# EasyEDA Pro project 呆瓜风扇.epro

# Schematic Schematic1
Board Name: Board1; Create Date: 2024-10-28
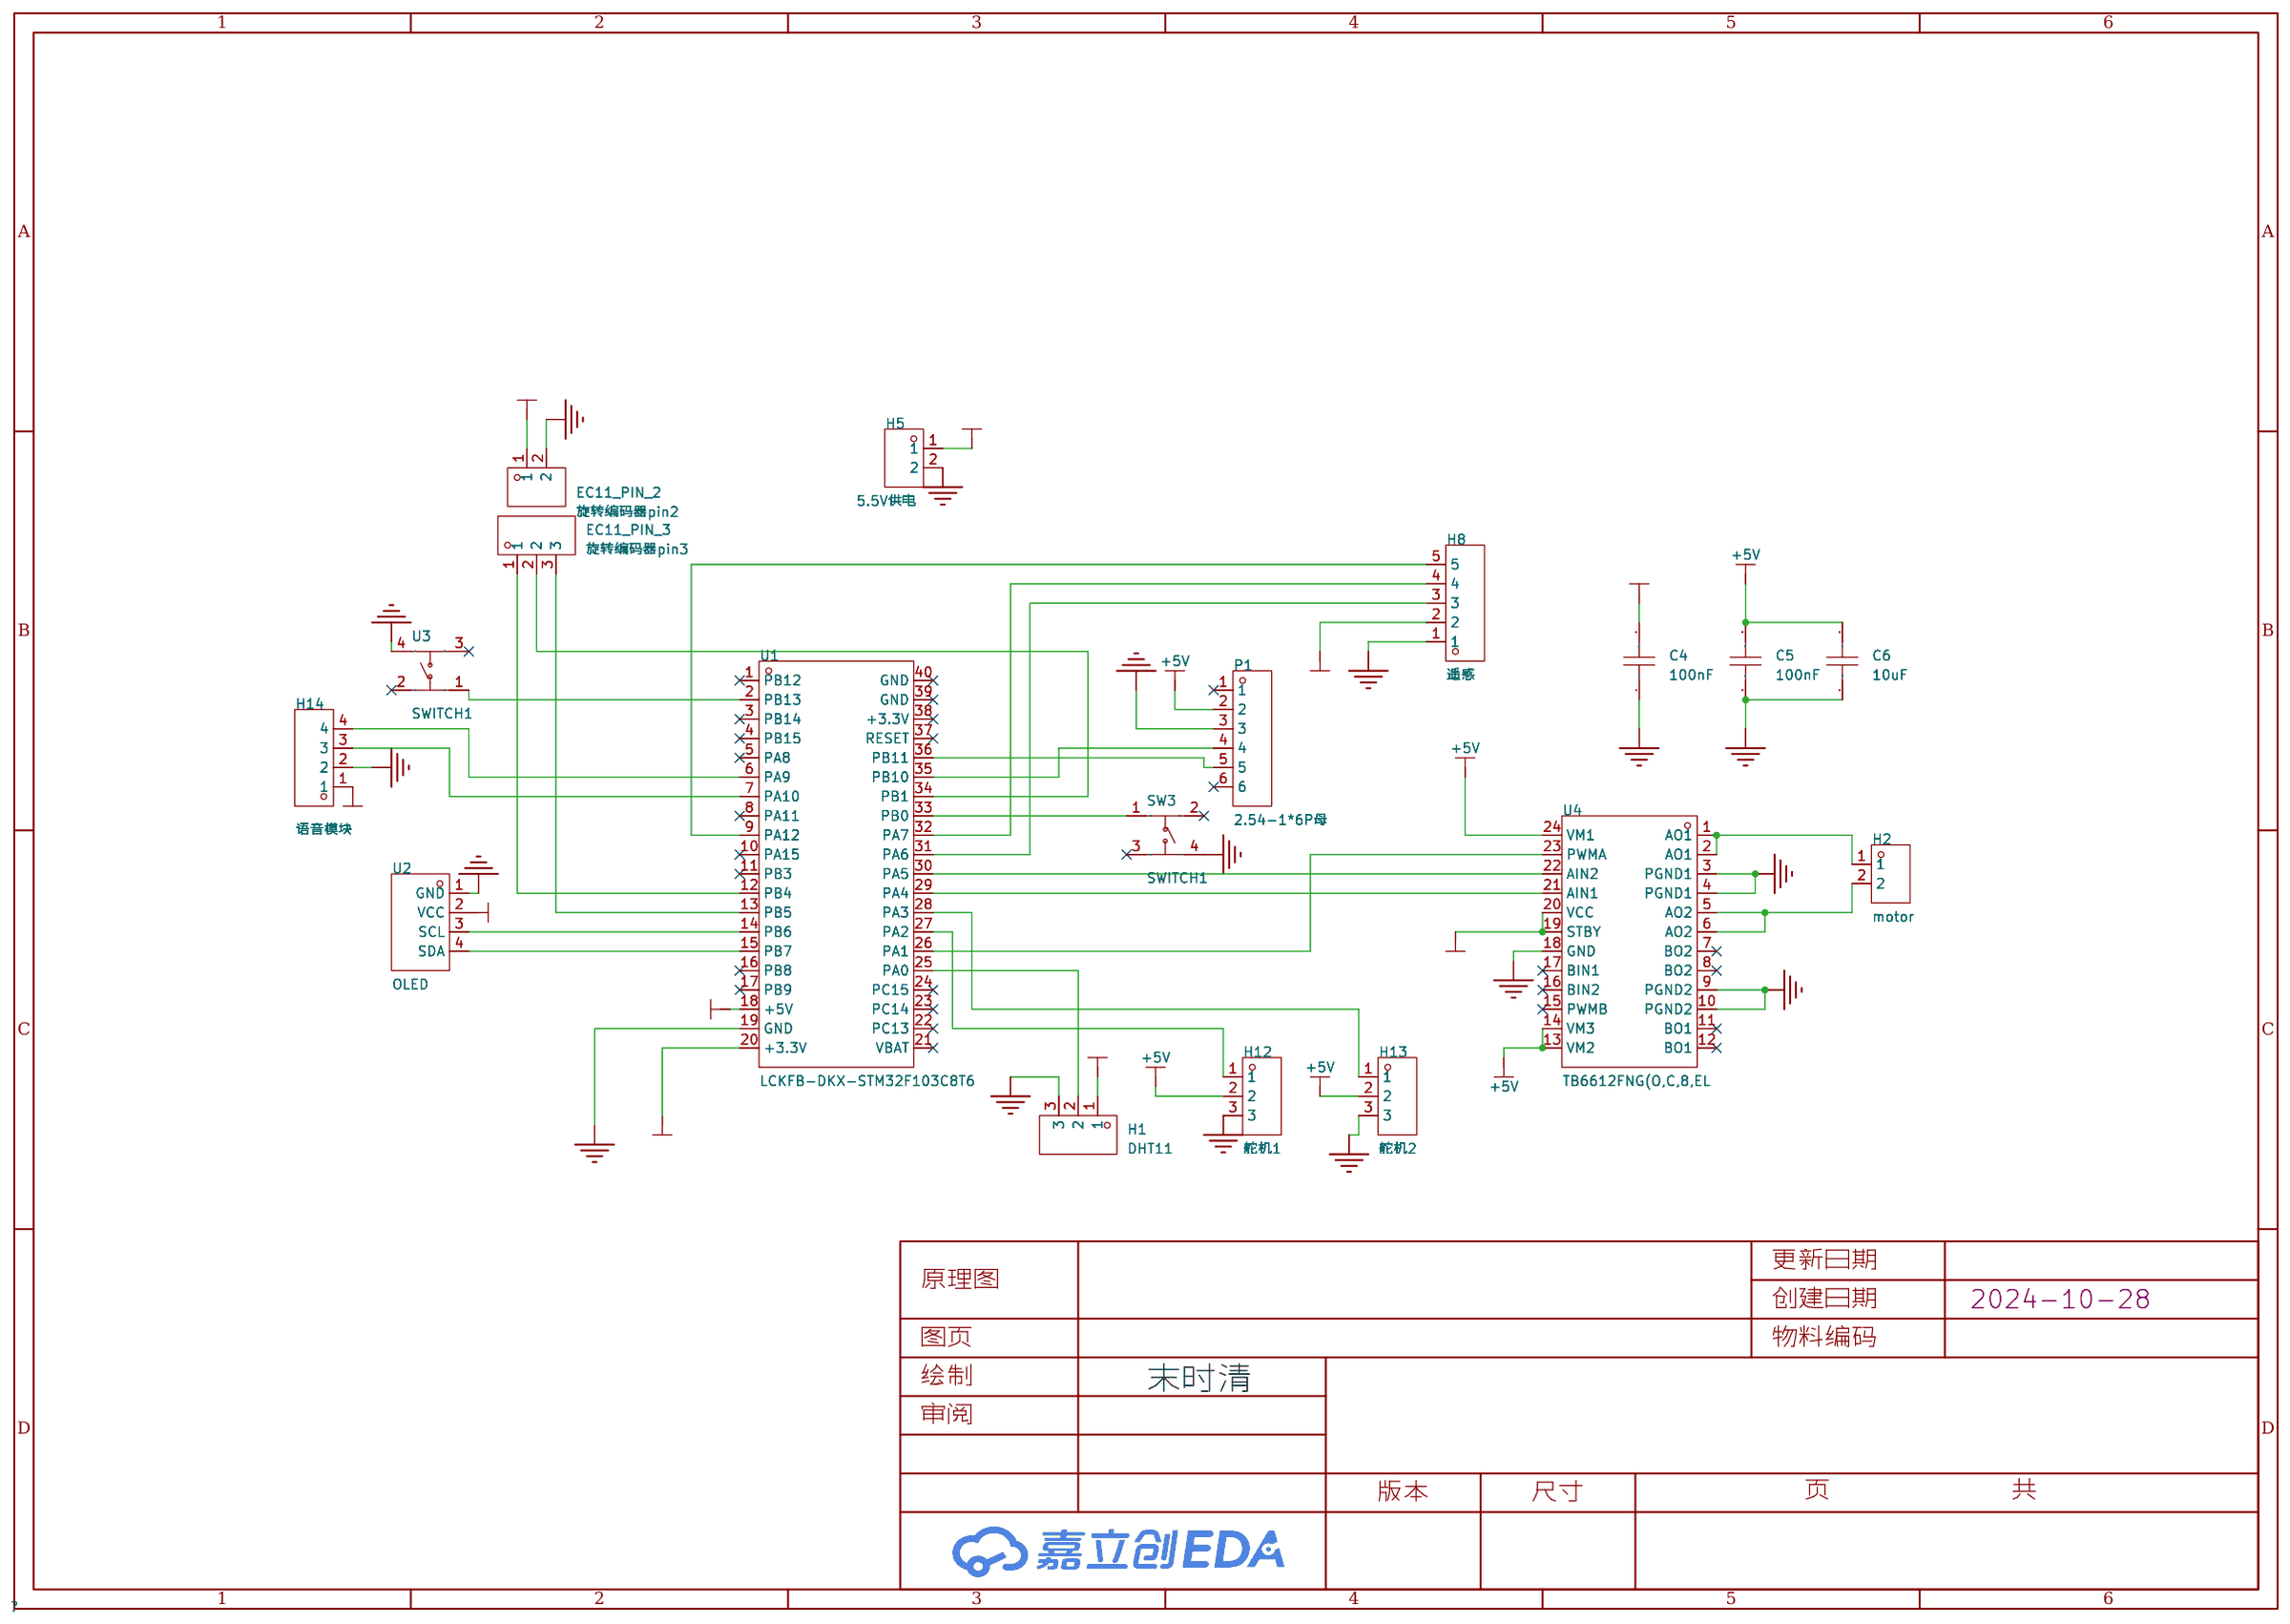
[diagram p0: schematic sheet]

## Parts
C4  100nF  [C0805]
C5  100nF  [C0805]
C6  100nF  [C0805]
EC11_PIN_2  旋转编码器pin2  [HDR-TH_2P-P2.54-V-M]
EC11_PIN_3  旋转编码器pin3  [HDR-TH_3P-P2.54-V-M]
H1  DHT11  [HDR-TH_3P-P2.54-V-F]
H2  motor  [HDR-TH_2P-P2.54-V-M]
H5  5.5V供电  [HDR-TH_2P-P2.54-V-M]
H8  遥感  [HDR-TH_5P-P2.54-V-M]
H12  舵机1  [HDR-TH_3P-P2.54-V-M]
H13  舵机2  [HDR-TH_3P-P2.54-V-M]
H14  语音模块  [HDR-TH_4P-P2.54-V-M]
P1  2.54-1*6P母  [HDR-TH_6P-P2.54-V-F]
SW3  SWITCH1  [SW-SMD_4P-L6.0-W6.0-P4.50-LS9.0-2]
U1  LCKFB-DKX-STM32F103C8T6  [CONN-TH_L53.3-W22.9_STM32F103C8T6-CARD]
U2  OLED  [OLED-TH_L27.8-W27.2-P2.54_C9900033791]
U3  SWITCH1  [SW-SMD_4P-L6.0-W6.0-P4.50-LS9.0-2]
U4  TB6612FNG(O,C,8,EL  [SSOP-24_L8.4-W5.8-P0.65-LS7.8-BL]

## Library data of the parts
C4-C6 = CAP_0805: Supplier Footprint: 0805
EC11_PIN_2 H2 H5 = PZ254V-11-02P: 插针结构:1x2P;间距:2.54mm;行距:-;圆针/方针:方针;安装类型:直插;排数:单排;总PIN位数:2P;额定电流:-;额定电压:-;配合针长度:6mm;塑高:2.5mm;端接针长度:3mm;触头材质:黄铜;触头镀层:-;工作温度范围:-40℃~+105℃;颜色:黑色;; LCSC Part Name: 间距:2.54mm 1x2P 直插 方针; Supplier Part: C492401; Manufacturer: XFCN(兴飞); Supplier Footprint: 插件,P=2.54mm; JLCPCB Part Class: 扩展库; Datasheet: https://atta.szlcsc.com/upload/public/pdf/source/20200309/C492401_A812433581A9B211A7FFA413ADDFF0E5.pdf; Supplier: LCSC; Pin Structure: 1x2P; Pitch: 2.54mm; Circluar Pins/Square Pins: 方针; Mounting Type: 直插; Number of Rows: 单排; Number of Pins: 2P; Length of Mating Pin: 6mm; Insulation Height: 2.5mm; Length of End Connection Pin: 3mm; Contact Material: 黄铜; Operating Temperature Range: -40℃~+105℃; Color: 黑色
EC11_PIN_3 H12 H13 = PZ254V-11-03P: 插针结构:1x3P;间距:2.54mm;行距:-;圆针/方针:方针;安装类型:直插;排数:单排;总PIN位数:3P;额定电流:3A;额定电压:250V;配合针长度:6mm;塑高:2.5mm;端接针长度:3mm;工作温度范围:-40℃~+105℃;颜色:黑色;; LCSC Part Name: 间距:2.54mm 1x3P 直插 方针; Supplier Part: C2937625; Manufacturer: XFCN(兴飞); Supplier Footprint: 插件,P=2.54mm; JLCPCB Part Class: 扩展库; Datasheet: https://atta.szlcsc.com/upload/public/pdf/source/20200309/C492402_8335C3D49C4E4C618838D59BB1D024C1.pdf; Supplier: LCSC; Pin Structure: 1x3P; Pitch: 2.54mm; Circluar Pins/Square Pins: 方针; Mounting Type: 直插; Number of Rows: 单排; Number of Pins: 3P; Current Rating (Max): 3A; Voltage Rating (Max): 250V; Length of Mating Pin: 6mm; Insulation Height: 2.5mm; Length of End Connection Pin: 3mm; Operating Temperature Range: -40℃~+105℃; Color: 黑色
H1 = PM254V-11-03-H85: 插孔结构:1x3P;间距:2.54mm;行距:-;安装类型:直插;排数:单排;总孔位数:3P;塑高:-;触头材质:黄铜;触头镀层:-;; LCSC Part Name: 间距:2.54mm 1x3P 直插; Supplier Part: C541850; Manufacturer: XFCN(兴飞); Supplier Footprint: 插件,P=2.54mm; JLCPCB Part Class: 扩展库; Datasheet: https://atta.szlcsc.com/upload/public/pdf/source/20200518/C541849_85853D71FC67C51915A806977A588FDA.pdf; Supplier: LCSC; Holes Structure: 1x3P; Pitch: 2.54mm; Mounting Type: 直插; Number of Rows: 单排; Number of Holes: 3P; Contact Material: 黄铜
H8 = PZ254V-11-05P: 插针结构:1x5P;间距:2.54mm;行距:-;圆针/方针:方针;安装类型:直插;排数:单排;总PIN位数:5P;额定电流:-;额定电压:-;配合针长度:6mm;塑高:2.5mm;端接针长度:3mm;触头材质:黄铜;触头镀层:-;工作温度范围:-40℃~+105℃;颜色:黑色;; LCSC Part Name: 间距:2.54mm 1x5P 直插 方针; Supplier Part: C492404; Manufacturer: XFCN(兴飞); Supplier Footprint: 插件,P=2.54mm; JLCPCB Part Class: 扩展库; Datasheet: https://atta.szlcsc.com/upload/public/pdf/source/20200309/C492404_E51533260F8710EFF5D4617281164C1D.pdf; Supplier: LCSC; Pin Structure: 1x5P; Pitch: 2.54mm; Circluar Pins/Square Pins: 方针; Mounting Type: 直插; Number of Rows: 单排; Number of Pins: 5P; Length of Mating Pin: 6mm; Insulation Height: 2.5mm; Length of End Connection Pin: 3mm; Contact Material: 黄铜; Operating Temperature Range: -40℃~+105℃; Color: 黑色
H14 = PZ254V-11-04P: 插针结构:1x4P;间距:2.54mm;行距:-;圆针/方针:方针;安装类型:直插;排数:单排;总PIN位数:4P;额定电流:3A;额定电压:250V;配合针长度:6mm;塑高:2.5mm;端接针长度:3mm;触头材质:-;工作温度范围:-40℃~+105℃;颜色:黑色;; LCSC Part Name: 间距:2.54mm 1x4P 直插 方针; Supplier Part: C2691448; Manufacturer: XFCN(兴飞); Supplier Footprint: 插件,P=2.54mm; JLCPCB Part Class: 扩展库; Datasheet: https://atta.szlcsc.com/upload/public/pdf/source/20200309/C492403_F9F19131791D08044AD4F84F8E751A34.pdf; Supplier: LCSC; Pin Structure: 1x4P; Pitch: 2.54mm; Circluar Pins/Square Pins: 方针; Mounting Type: 直插; Number of Rows: 单排; Number of Pins: 4P; Current Rating (Max): 3A; Voltage Rating (Max): 250V; Length of Mating Pin: 6mm; Insulation Height: 2.5mm; Length of End Connection Pin: 3mm; Operating Temperature Range: -40℃~+105℃; Color: 黑色
P1 = 2.54-1*6P母: 插孔结构:1x6P;间距:2.54mm;行距:-;安装类型:直插;排数:单排;总孔位数:6P;塑高:-;触头材质:-;触头镀层:-;; LCSC Part Name: 间距:2.54mm 1x6P 直插; Supplier Part: C40877; Manufacturer: BOOMELE(博穆精密); Supplier Footprint: 插件,P=2.54mm; JLCPCB Part Class: 扩展库; Datasheet: https://atta.szlcsc.com/upload/public/pdf/source/20210301/C2718488_F4427B881E42CAA8DDB0B1C12B3A522C.pdf; Supplier: LCSC; Holes Structure: 1x6P; Pitch: 2.54mm; Mounting Type: 直插; Number of Rows: 单排; Number of Holes: 6P
SW3 U3 = KH-6X6X5H-STM: 电路结构:单刀单掷;按钮形状:圆形按钮;安装方式:立贴;开关长度:6mm;开关宽度:6mm;开关高度:5mm;带支架:不带;触点电流:50mA;额定电压(DC):12V;机械寿命:8万次;; LCSC Part Name: 6*6*5mm 立贴 轻触开关; Supplier Part: C2837531; Manufacturer: kinghelm(金航标); Supplier Footprint: SMD; JLCPCB Part Class: 扩展库; Datasheet: https://atta.szlcsc.com/upload/public/pdf/source/20210608/C2837531_45E87AB996CE723B09405FF2EA209C4C.pdf; Supplier: LCSC; Circuit: 单刀单掷; Actuator Style: 圆形按钮; Mounting Style: 立贴; Switch Length: 6mm; Switch Width: 6mm; Switch Height: 5mm; Strike Gundam: 不带; Contact Current: 50mA; Voltage Rating (DC): 12V; Actuator/Cap Color: 黑色; Pin Style: 鸥翼型; Mechanical Life: 8万次
U1 = LCKFB-DKX-STM32F103C8T6: LCSC Part Name: 立创·地阔星-STM32F103C8T6开发板; Supplier Part: C22396880; Manufacturer: 立创开发板; JLCPCB Part Class: 扩展库; Datasheet: https://atta.szlcsc.com/upload/public/pdf/source/20240801/7EEF69F7480DF7C6DA98696664D658D4.pdf; Supplier: LCSC
U2 = HS96L03W2C03: 主控芯片:SSD1315;接口类型:I2C;尺寸(inch):0.96;像素分辨率:128x64;; LCSC Part Name: 0.96寸OLED显示屏窄白光IIC; Supplier Part: C5248080; Manufacturer: HS(汉昇); JLCPCB Part Class: 扩展库; Datasheet: https://atta.szlcsc.com/upload/public/pdf/source/20230627/763D01F79A90007632F098068C7C8AD9.pdf; Supplier: LCSC; Main Control Chip: SSD1315; Interface Type: I2C; Size: 0.96; Pixel Resolution: 128x64; Operating Temperature: -40℃~+70℃
U4 = TB6612FNG(O,C,8,EL: 双直流电机驱动器集成电路; Supplier Part: C88224; Manufacturer: TOSHIBA(东芝); Supplier Footprint: SSOP-24-208mil; JLCPCB Part Class: 扩展库; Datasheet: https://atta.szlcsc.com/upload/public/pdf/source/20171128/C141517_15118625624231147036.pdf; Supplier: LCSC

## Nets
+3.3V: C4.2 EC11_PIN_2.1 H1.1 U1.20(+3.3V) U2.2(VCC) U4.19(STBY) U4.20(VCC)
+5V: C5.2 C6.2 H5.1 H8.2 H12.2 H13.2 H14.1 P1.2 U1.18(+5V) U4.13(VM2) U4.14(VM3) U4.24(VM1)
GND: C4.1 C5.1 C6.1 EC11_PIN_2.2 H1.3 H5.2 H8.1 H12.3 H13.3 H14.2 P1.3 SW3.4 U1.19(GND) U2.1(GND) U3.4 U4.3(PGND1) U4.4(PGND1) U4.9(PGND2) U4.10(PGND2) U4.18(GND)
$1N3188: U1.26(PA1) U4.23(PWMA)
$1N3195: U1.30(PA5) U4.22(AIN2)
$1N3199: U1.29(PA4) U4.21(AIN1)
$1N3223: H2.1 U4.1(AO1) U4.2(AO1)
$1N3233: H2.2 U4.5(AO2) U4.6(AO2)
$1N4264: EC11_PIN_3.1 U1.12(PB4)
$1N4270: EC11_PIN_3.2 U1.34(PB1)
$1N4350: SW3.1 U1.33(PB0)
$1N4413: H1.2 U1.25(PA0)
$1N5263: H14.3 U1.7(PA10)
$1N6759: EC11_PIN_3.3 U1.13(PB5)
$1N6773: U1.15(PB7) U2.4(SDA)
$1N6777: U1.14(PB6) U2.3(SCL)
$1N7016: H13.1 U1.28(PA3)
$1N7020: H12.1 U1.27(PA2)
$1N7182: H8.3 U1.31(PA6)
$1N7191: H8.4 U1.32(PA7)
$1N7282: U1.2(PB13) U3.1
$1N7288: H8.5 U1.9(PA12)
$1N7604: P1.4 U1.35(PB10)
$1N7610: P1.5 U1.36(PB11)
$1N8073: H14.4 U1.6(PA9)

Not connected (* = marked no-connect by the designer): P1 1* 6*; SW3 2* 3*; U1 1(PB12)* 3(PB14)* 4(PB15)* 5(PA8)* 8(PA11)* 10(PA15)* 11(PB3)* 16(PB8)* 17(PB9)* 21(VBAT)* 22(PC13)* 23(PC14)* 24(PC15)* 37(RESET)* 38(+3.3V)* 39(GND)* 40(GND)*; U3 2* 3*; U4 7(BO2)* 8(BO2)* 11(BO1)* 12(BO1)* 15(PWMB)* 16(BIN2)* 17(BIN1)*

## Notes on the sheet
- 末时清

# Board PCB1
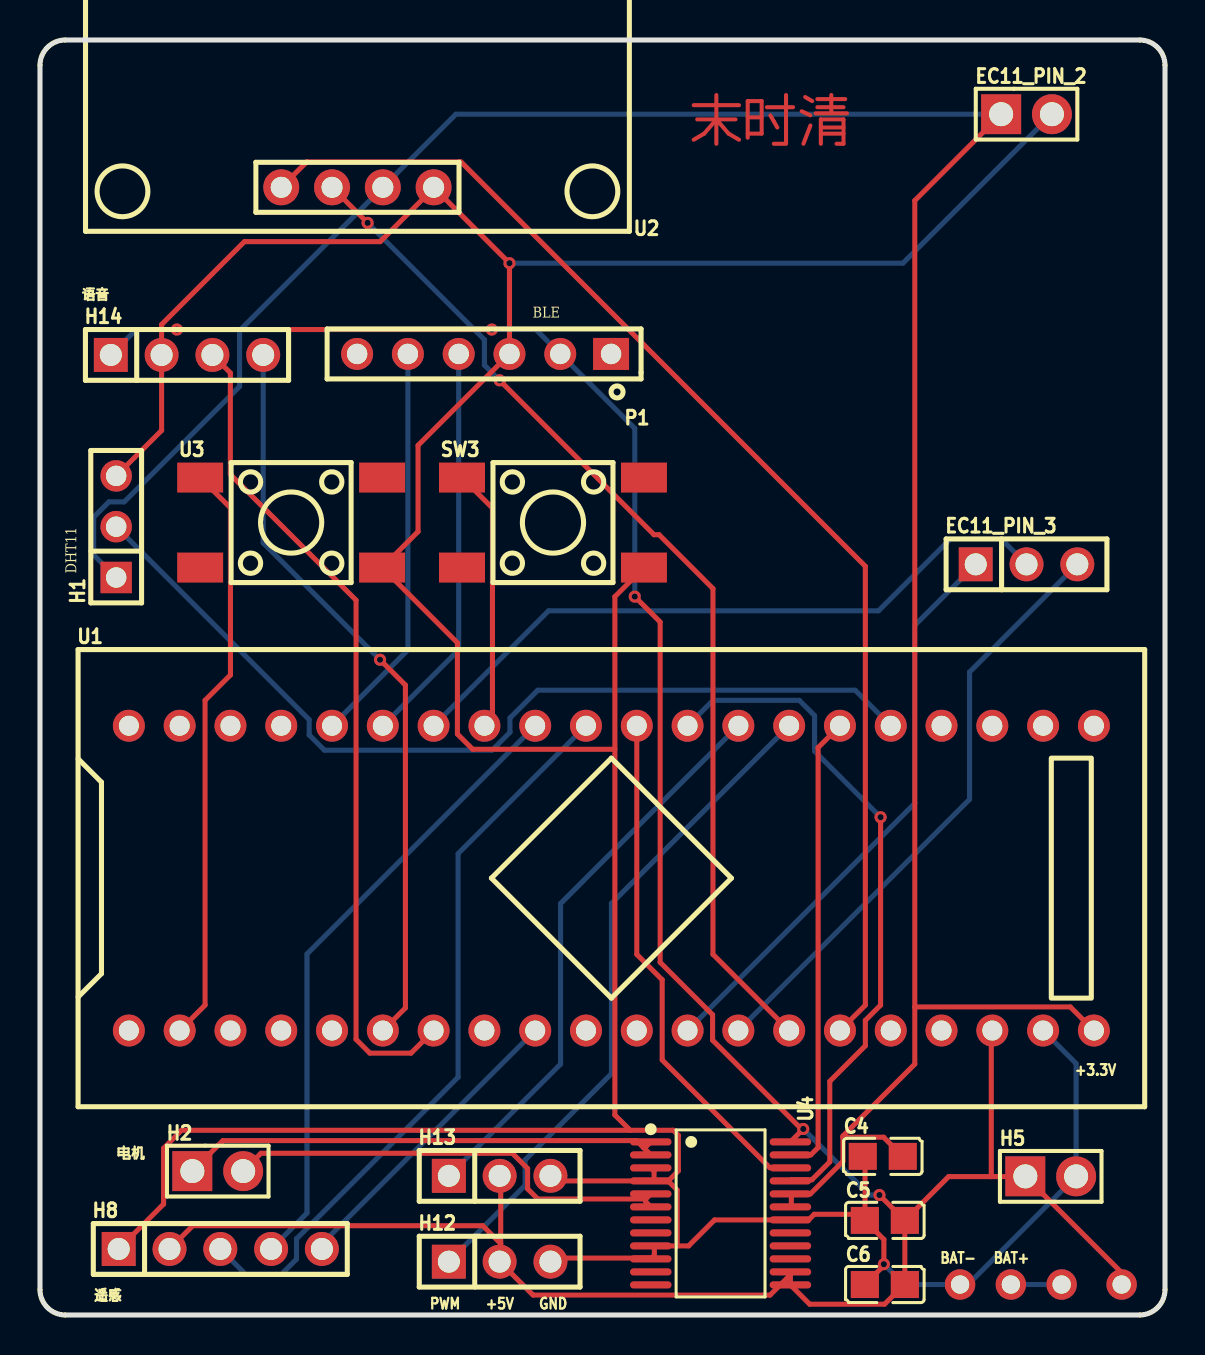
[diagram p1: board, top side]
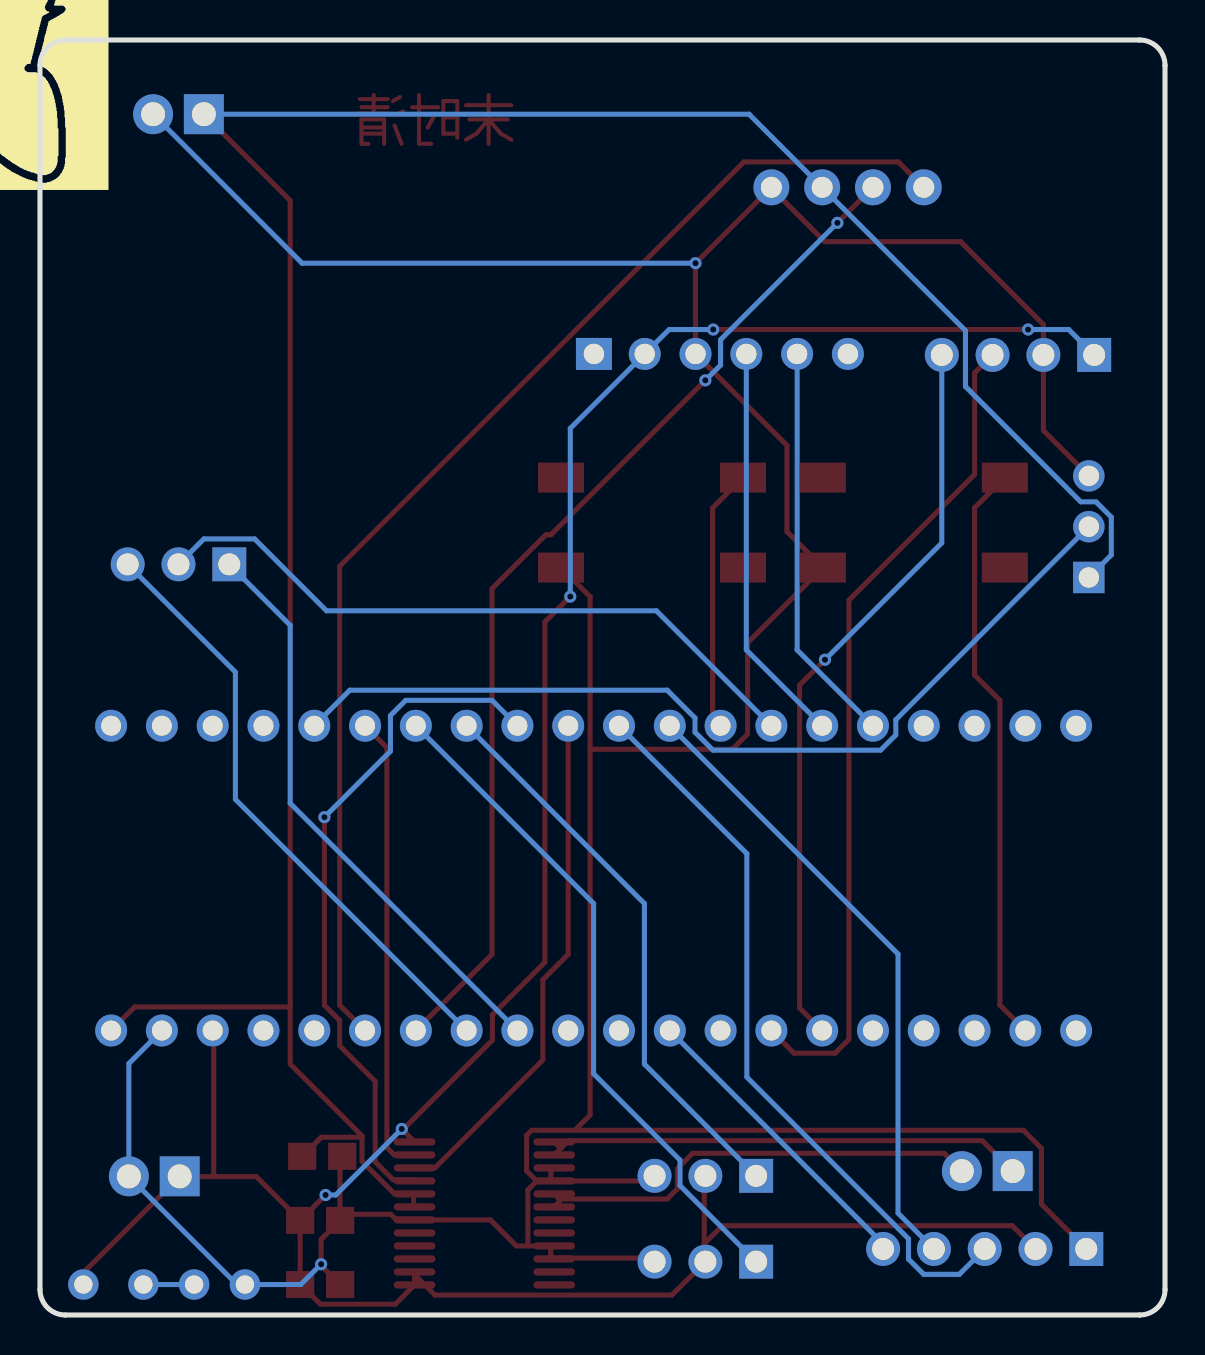
[diagram p2: board, bottom side, seen from below]

Outline 56.26 x 63.75 mm; copper layers: Top Layer, Bottom Layer. Coordinates in mm from the lower left corner of the outline.
Outline path: 0,62.48 0,1.27 arc(0.37,0.37) 1.27,0 54.99,0 arc(55.89,0.37) 56.26,1.27 56.26,62.48 arc(55.89,63.38) 54.99,63.75 1.27,63.75 arc(0.37,63.38) 0,62.48
Stack: Top Layer 0.035mm / Dielectric1 1.51mm FR4 er 4.5 / Bottom Layer 0.035mm

## Design rules (mm)
template: JLCPCB Capability(Two Layers Board)
spacing copperThickness1oz (default): track to track 0.102, other pairs 0.152 to 0.3
spacing copperThickness2oz: track to track 0.203, other pairs 0.152 to 0.3
track width copperThickness1oz (default): min 0.127, default 0.254, max 2.54
track width copperThickness2oz: min 0.203, default 0.254, max 2.54
differential pair differentialPair (default): width min 0.127, default 0.254, max 2.54; gap min 0.152, default 0.152
via viaSize (default): diameter min 0.5, default 0.61, max 10; hole min 0.3, default 0.305, max 6.3

## Placement (name value [footprint] x y rotation side)
C4  100nF  [C0805]  42.15 7.93 0 top
C5  100nF  [C0805]  42.25 4.73 0 top
C6  100nF  [C0805]  42.25 1.52 0 top
EC11_PIN_2  旋转编码器pin2  [HDR-TH_2P-P2.54-V-M]  49.34 60.04 0 top
EC11_PIN_3  旋转编码器pin3  [HDR-TH_3P-P2.54-V-M]  49.34 37.54 0 top
H1  DHT11  [HDR-TH_3P-P2.54-V-F]  3.81 39.42 90 top
H2  motor  [HDR-TH_2P-P2.54-V-M]  8.89 7.2 0 top
H5  5.5V供电  [HDR-TH_2P-P2.54-V-M]  50.55 6.93 0 top
H8  遥感  [HDR-TH_5P-P2.54-V-M]  9.02 3.3 0 top
H12  舵机1  [HDR-TH_3P-P2.54-V-M]  22.99 2.67 0 top
H13  舵机2  [HDR-TH_3P-P2.54-V-M]  22.99 6.96 0 top
H14  语音模块  [HDR-TH_4P-P2.54-V-M]  7.35 48.01 0 top
NOREF  -  [Pad_e1286]  51.09 1.52 0 top
NOREF#2  -  [Pad_e1283]  46.01 1.52 0 top
NOREF#3  -  [Pad_e2]  54.09 1.52 0 top
NOREF#4  -  [Pad_e3]  48.55 1.52 0 top
P1  2.54-1*6P母  [HDR-TH_6P-P2.54-V-F]  22.21 48.06 180 top
SW3  SWITCH1  [SW-SMD_4P-L6.0-W6.0-P4.50-LS9.0-2]  25.65 39.62 0 top
U1  LCKFB-DKX-STM32F103C8T6  [CONN-TH_L53.3-W22.9_STM32F103C8T6-CARD]  28.58 21.84 0 top
U2  OLED  [OLED-TH_L27.8-W27.2-P2.54_C9900033791]  15.87 56.39 180 top
U3  SWITCH1  [SW-SMD_4P-L6.0-W6.0-P4.50-LS9.0-2]  12.56 39.62 0 top
U4  TB6612FNG(O,C,8,EL  [SSOP-24_L8.4-W5.8-P0.65-LS7.8-BL]  34.04 5.08 270 top

## Footprints (pads in the part's own frame, mm; a bottom-side part is the same pattern mirrored in y, then rotated)
C0805
  rect 1.41x1.35 smd: 1(-1,0) 2(1,0)
CONN-TH_L53.3-W22.9_STM32F103C8T6-CARD
  round 1.6 hole 1: 1(-24.13,-7.62) 2(-21.59,-7.62) 3(-19.05,-7.62) 4(-16.51,-7.62) 5(-13.97,-7.62) 6(-11.43,-7.62) 7(-8.89,-7.62) 8(-6.35,-7.62) 9(-3.81,-7.62) 10(-1.27,-7.62) 11(1.27,-7.62) 12(3.81,-7.62) 13(6.35,-7.62) 14(8.89,-7.62) 15(11.43,-7.62) 16(13.97,-7.62) 17(16.51,-7.62) 18(19.05,-7.62) 19(21.59,-7.62) 20(24.13,-7.62) 21(24.13,7.62) 22(21.59,7.62) 23(19.05,7.62) 24(16.51,7.62) 25(13.97,7.62) 26(11.43,7.62) 27(8.89,7.62) 28(6.35,7.62) 29(3.81,7.62) 30(1.27,7.62) 31(-1.27,7.62) 32(-3.81,7.62) 33(-6.35,7.62) 34(-8.89,7.62) 35(-11.43,7.62) 36(-13.97,7.62) 37(-16.51,7.62) 38(-19.05,7.62) 39(-21.59,7.62) 40(-24.13,7.62)
HDR-TH_2P-P2.54-V-M
  rect 2x2 hole 1.2: 1(-1.27,0)
  round 2 hole 1.2: 2(1.27,0)
HDR-TH_3P-P2.54-V-F
  rect 1.575x1.575 hole 1.02: 1(-2.54,0)
  round 1.575 hole 1.02: 2(0,0) 3(2.54,0)
HDR-TH_3P-P2.54-V-M
  rect 1.7x1.7 hole 1.1: 1(-2.54,0)
  round 1.7 hole 1.1: 2(0,0) 3(2.54,0)
HDR-TH_4P-P2.54-V-M
  rect 1.7x1.7 hole 1.1: 1(-3.81,0)
  round 1.7 hole 1.1: 2(-1.27,0) 3(1.27,0) 4(3.81,0)
HDR-TH_5P-P2.54-V-M
  rect 1.7x1.7 hole 1.1: 1(-5.08,0)
  round 1.7 hole 1.1: 2(-2.54,0) 3(0,0) 4(2.54,0) 5(5.08,0)
HDR-TH_6P-P2.54-V-F
  rect 1.8x1.6 hole 1.02: 1(-6.35,0)
  round 1.6 hole 1.02: 2(-3.81,0) 3(-1.27,0) 4(1.27,0) 5(3.81,0) 6(6.35,0)
OLED-TH_L27.8-W27.2-P2.54_C9900033791
  round 1.8 hole 1.05: 1(-3.81,0) 2(-1.27,0) 3(1.27,0) 4(3.81,0)
Pad_e2
  round 1.524 hole 0.914: 1(0,0)
Pad_e3
  round 1.524 hole 0.914: 1(0,0)
Pad_e1283
  round 1.524 hole 0.914: 1(0,0)
Pad_e1286
  round 1.524 hole 0.914: 1(0,0)
SSOP-24_L8.4-W5.8-P0.65-LS7.8-BL
  oval 0.364x2.082 smd: 1(-3.575,-3.491) 2(-2.925,-3.491) 3(-2.275,-3.491) 4(-1.625,-3.491) 5(-0.975,-3.491) 6(-0.325,-3.491) 7(0.325,-3.491) 8(0.975,-3.491) 9(1.625,-3.491) 10(2.275,-3.491) 11(2.925,-3.491) 12(3.575,-3.491) 13(3.575,3.491) 14(2.925,3.491) 15(2.275,3.491) 16(1.625,3.491) 17(0.975,3.491) 18(0.325,3.491) 19(-0.325,3.491) 20(-0.975,3.491) 21(-1.625,3.491) 22(-2.275,3.491) 23(-2.925,3.491) 24(-3.575,3.491)
SW-SMD_4P-L6.0-W6.0-P4.50-LS9.0-2
  rect 2.3x1.5 smd: 1(-4.55,2.25) 2(4.55,2.25) 3(-4.55,-2.25) 4(4.55,-2.25)

## Nets
As in the schematic, except:
+5V: C5.2 C6.2 H5.1 H8.2 H12.2 H13.2 H14.1 NOREF#3.1 P1.2 U1.18 U4.13 U4.14 U4.24
GND: C4.1 C5.1 C6.1 EC11_PIN_2.2 H1.3 H5.2 H8.1 H12.3 H13.3 H14.2 NOREF#2.1 P1.3 SW3.4 U1.19 U2.1 U3.4 U4.3 U4.4 U4.9 U4.10 U4.18
BAT+: NOREF.1 NOREF#4.1

Pads without a net: P1 1 6; SW3 2 3; U1 1 3 4 5 8 10 11 16 17 21 22 23 24 37 38 39 40; U3 2 3; U4 7 8 11 12 15 16 17

## Via types
v1: diameter 0.61, hole 0.305, Top Layer to Bottom Layer, 11 vias

## Routing (per net, layer and track width the routed paths; a pad name or vN(x,y) marks a point on that pad's centre or on a via; arc(x,y) is an arc through that point)
+3.3V: length 131.3
  Top Layer w0.254: U1.20 51.53,15.4 43.75,15.4 ; 43.75,15.4 43.75,12.55 40.16,8.95 40.16,8.89 ; 43.75,15.4 43.75,55.73 EC11_PIN_2.1 ; C4.2 42.19,8.89 40.16,8.89 ; 37.57,6.06 38.53,6.06 40.16,7.68 40.16,8.89 ; 37.57,6.06 U4.20 ; 37.57,6.06 37.57,5.45 U4.19
  Bottom Layer w0.254: H1.1 2.69,38 2.69,39.9 3.45,40.66 4.21,40.66 9.98,46.43 9.98,49.22 U2.2 20.8,60.04 EC11_PIN_2.1
+5V: length 144.7
  Top Layer w0.254: 37.53,2.01 37.53,1.5 38.49,0.54 42.23,0.54 43.25,1.56 ; 37.53,2.01 U4.14 ; 37.53,2.01 36.51,1 24.66,1 23.04,2.61 ; v1(22.59,49.28) v1(6.85,49.28) ; NOREF#3.1 54.09,2.12 49.29,6.92 ; C5.2 v1(41.98,6) ; C5.2 43.25,1.56 ; C5.2 45.44,6.92 47.57,6.92 ; v1(38.17,9.3) 38.12,9.25 ; 38.12,9.25 U4.24 ; 38.12,9.25 33.64,13.74 33.64,15.01 31.01,17.64 31.01,34.65 v1(29.74,35.92) ; 43.25,1.56 C6.2 ; 23.04,3.57 22.14,4.46 7.64,4.46 H8.2 ; 23.04,3.57 23.04,6.9 H13.2 ; 23.04,3.57 23.04,2.61 ; U1.18 47.57,14.17 47.57,6.92 ; 47.57,6.92 49.29,6.92 ; 49.29,6.92 H5.1 ; 23.04,2.61 H12.2
  Bottom Layer w0.254: v1(41.98,6) 41.47,6 v1(38.17,9.3) ; v1(29.74,35.92) 29.74,44.33 P1.2 24.8,49.28 v1(22.59,49.28) ; v1(6.85,49.28) 4.81,49.28 H14.1
GND: length 215.1
  Top Layer w0.254: 41.26,4.72 C5.1 ; 41.26,4.72 42.2,3.78 v1(42.2,2.54) 42.2,2.48 C6.1 ; 41.26,4.72 41.26,5.04 ; 28.75,28.29 28.75,10 29.51,9.24 ; 28.75,28.29 21.64,28.29 20.88,29.05 20.88,33.61 U3.4 18.91,39.17 18.91,43.48 P1.3 v1(23.48,52.59) 19.71,56.37 ; 28.75,28.29 28.75,35.92 SW3.4 ; 29.51,9.24 7.08,9.24 6.18,8.34 6.18,5.55 H8.1 ; 29.51,9.24 31.67,9.24 31.92,8.98 31.92,7.21 31.42,6.7 ; 30.71,6.71 U4.4 25.78,6.71 H13.3 ; 30.71,6.71 30.71,7.19 U4.3 ; 30.71,6.71 31.41,6.71 31.42,6.7 ; 41.26,5.04 38.72,5.04 38.44,4.75 U4.18 33.74,4.75 32.44,3.46 31.87,3.46 ; 41.26,5.04 41.26,7.82 C4.1 ; 30.72,3.46 30.72,2.98 30.59,2.85 ; 30.72,3.46 31.87,3.46 ; 30.72,3.46 U4.9 ; H1.3 6.08,44.23 H14.2 6.08,49.53 10.22,53.67 17.01,53.67 19.71,56.37 ; 31.42,6.7 31.87,6.25 31.87,3.46 ; 30.59,2.85 U4.10 ; 30.59,2.85 25.71,2.85 H12.3 ; 19.71,56.37 U2.1
  Bottom Layer w0.254: U1.19 51.82,12.57 51.82,6.93 46.41,1.52 NOREF#2.1 43.22,1.52 v1(42.2,2.54) ; v1(23.48,52.59) 43.16,52.59 EC11_PIN_2.2
BAT+: length 2.5
  Bottom Layer w0.254: NOREF.1 NOREF#4.1
$1N3188: length 23.1
  Top Layer w0.254: U1.26 38.91,28.37 38.91,8.38 38.54,8 37.53,8
$1N3195: length 25.9
  Top Layer w0.254: U4.22 37.52,7.36 36.5,7.36 31.11,12.75 31.11,16.76 29.84,18.03 U1.30
$1N3199: length 34.3
  Top Layer w0.254: v1(42.04,24.89) 42.04,15.49 41.27,14.73 41.27,13.46 39.5,11.68 39.5,7.66 38.6,6.76 37.58,6.76 U4.21
  Bottom Layer w0.254: v1(42.04,24.89) 38.73,28.19 38.73,29.97 37.97,30.73 33.65,30.73 U1.29
$1N3223: length 24.3
  Top Layer w0.254: 30.19,8.36 29.83,8.72 9.14,8.72 7.62,7.2 ; 30.19,8.36 30.25,8.36 U4.1 ; 30.19,8.36 30.55,8
$1N3233: length 22.9
  Top Layer w0.254: 30.29,5.8 30.29,5.66 U4.6 ; 30.29,5.8 24.89,5.8 24.38,6.31 24.38,7.33 23.62,8.09 11.05,8.09 H2.2 ; 30.29,5.8 U4.5
$1N4264: length 29.3
  Bottom Layer w0.254: EC11_PIN_3.1 43.75,34.49 43.75,25.59 U1.12
$1N4270: length 34
  Bottom Layer w0.254: U1.34 25.43,35.21 41.93,35.21 45.53,38.81 48.07,38.81 EC11_PIN_3.2
$1N4350: length 13.2
  Top Layer w0.254: SW3.1 22.63,40.35 22.63,29.87 U1.33
$1N4413: length 46.2
  Bottom Layer w0.254: U1.25 40.77,31.24 24.89,31.24 23.5,29.85 23.5,29.14 22.61,28.24 14.22,28.24 13.46,29 13.46,29.77 H1.2
$1N5263: length 41.8
  Top Layer w0.254: H14.3 9.52,47.11 9.52,42.03 15.81,35.74 15.81,13.78 16.5,13.09 18.56,13.09 U1.7
$1N6759: length 30.3
  Bottom Layer w0.254: U1.13 46.49,25.79 46.49,32.15 EC11_PIN_3.3
$1N6773: length 61.9
  Top Layer w0.254: U2.4 13.33,57.66 21.05,57.66 41.27,37.44 41.27,15.49 U1.15
$1N6777: length 51.8
  Top Layer w0.254: U1.14 33.65,18.03 33.65,36.32 30.96,39.02 30.71,39.02 v1(22.99,46.74) ; v1(16.38,54.61) U2.3
  Bottom Layer w0.254: v1(22.99,46.74) 22.22,47.5 22.22,48.77 v1(16.38,54.61)
$1N7016: length 28.5
  Bottom Layer w0.254: U1.28 26.03,20.57 26.03,12.55 H13.1
$1N7020: length 33.8
  Bottom Layer w0.254: U1.27 28.58,20.57 28.58,12.07 24.26,7.75 24.26,6.48 H12.1
$1N7182: length 37.3
  Bottom Layer w0.254: H8.3 10.29,2.03 12.06,2.03 12.83,2.79 12.83,3.81 20.91,11.89 20.91,23.07 U1.31
$1N7191: length 31.6
  Bottom Layer w0.254: U1.32 13.35,18.05 13.35,5.1 H8.4
$1N7282: length 29.3
  Top Layer w0.254: U1.2 8.25,15.49 8.25,30.73 9.52,32 9.52,40.36 U3.1
$1N7288: length 15.3
  Bottom Layer w0.254: H8.5 14.1,3.56 U1.9
$1N7604: length 20.2
  Bottom Layer w0.254: U1.35 20.94,33.26 P1.4
$1N7610: length 20.2
  Bottom Layer w0.254: U1.36 18.4,33.26 P1.5
$1N8073: length 37.2
  Top Layer w0.254: U1.6 18.27,15.35 18.27,31.5 v1(17,32.77)
  Bottom Layer w0.254: H14.4 11.16,38.61 v1(17,32.77)

## Text on the board
Top Layer: 末时清
Top Silkscreen Layer: PWM | +5V | GND | BAT- | BAT+ | +3.3V | 语音 | 遥感 | 电机 | BLE | DHT11
